# Altium schematic sheet differential_lowpass.SchDoc: Differential low-pass filter
size A4
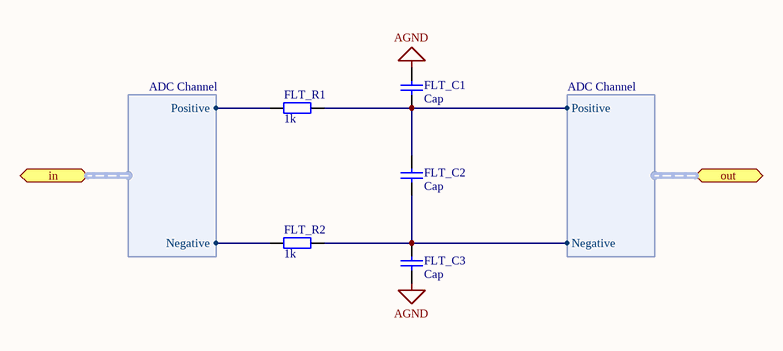
[diagram p0: differential_lowpass.SchDoc]

## Parts
FLT_C1  Cap  [SMD_Capacitor_0603]
FLT_C2  Cap  [SMD_Capacitor_0603]
FLT_C3  Cap  [SMD_Capacitor_0603]
FLT_R1  1k  [SMD_Resistor_0603]
FLT_R2  1k  [SMD_Resistor_0603]

## Ports
in (harness ADC Channel), out (harness ADC Channel)

## Harnesses
ADC Channel: Positive, Negative

## Nets
AGND: FLT_C1.1 FLT_C3.2
NetFLT_C1_2: FLT_C1.2 FLT_C2.1 FLT_R1.2 ; port out.Positive
NetFLT_C2_2: FLT_C2.2 FLT_C3.1 FLT_R2.2 ; port out.Negative
NetFLT_R1_1: FLT_R1.1 ; port in.Positive
NetFLT_R2_1: FLT_R2.1 ; port in.Negative

## Notes on the sheet
- Title:
- Sheet:
- of
- Author:
- Model:
- Document Number:
- Checked by:
- Iss-Rev:
- Approved by:
- Date:
- File name:

## Library data of the parts
FLT_R1 FLT_R2 = Res: Value: 1k; Package: 0603
FLT_C1-FLT_C3 = Cap: Value: Cap; Package: 0603